# Altium schematic sheet 8_Zyntra-Ethernet.SchDoc
size 406 x 241 mm; SheetNumber: 8; SheetTotal: 10
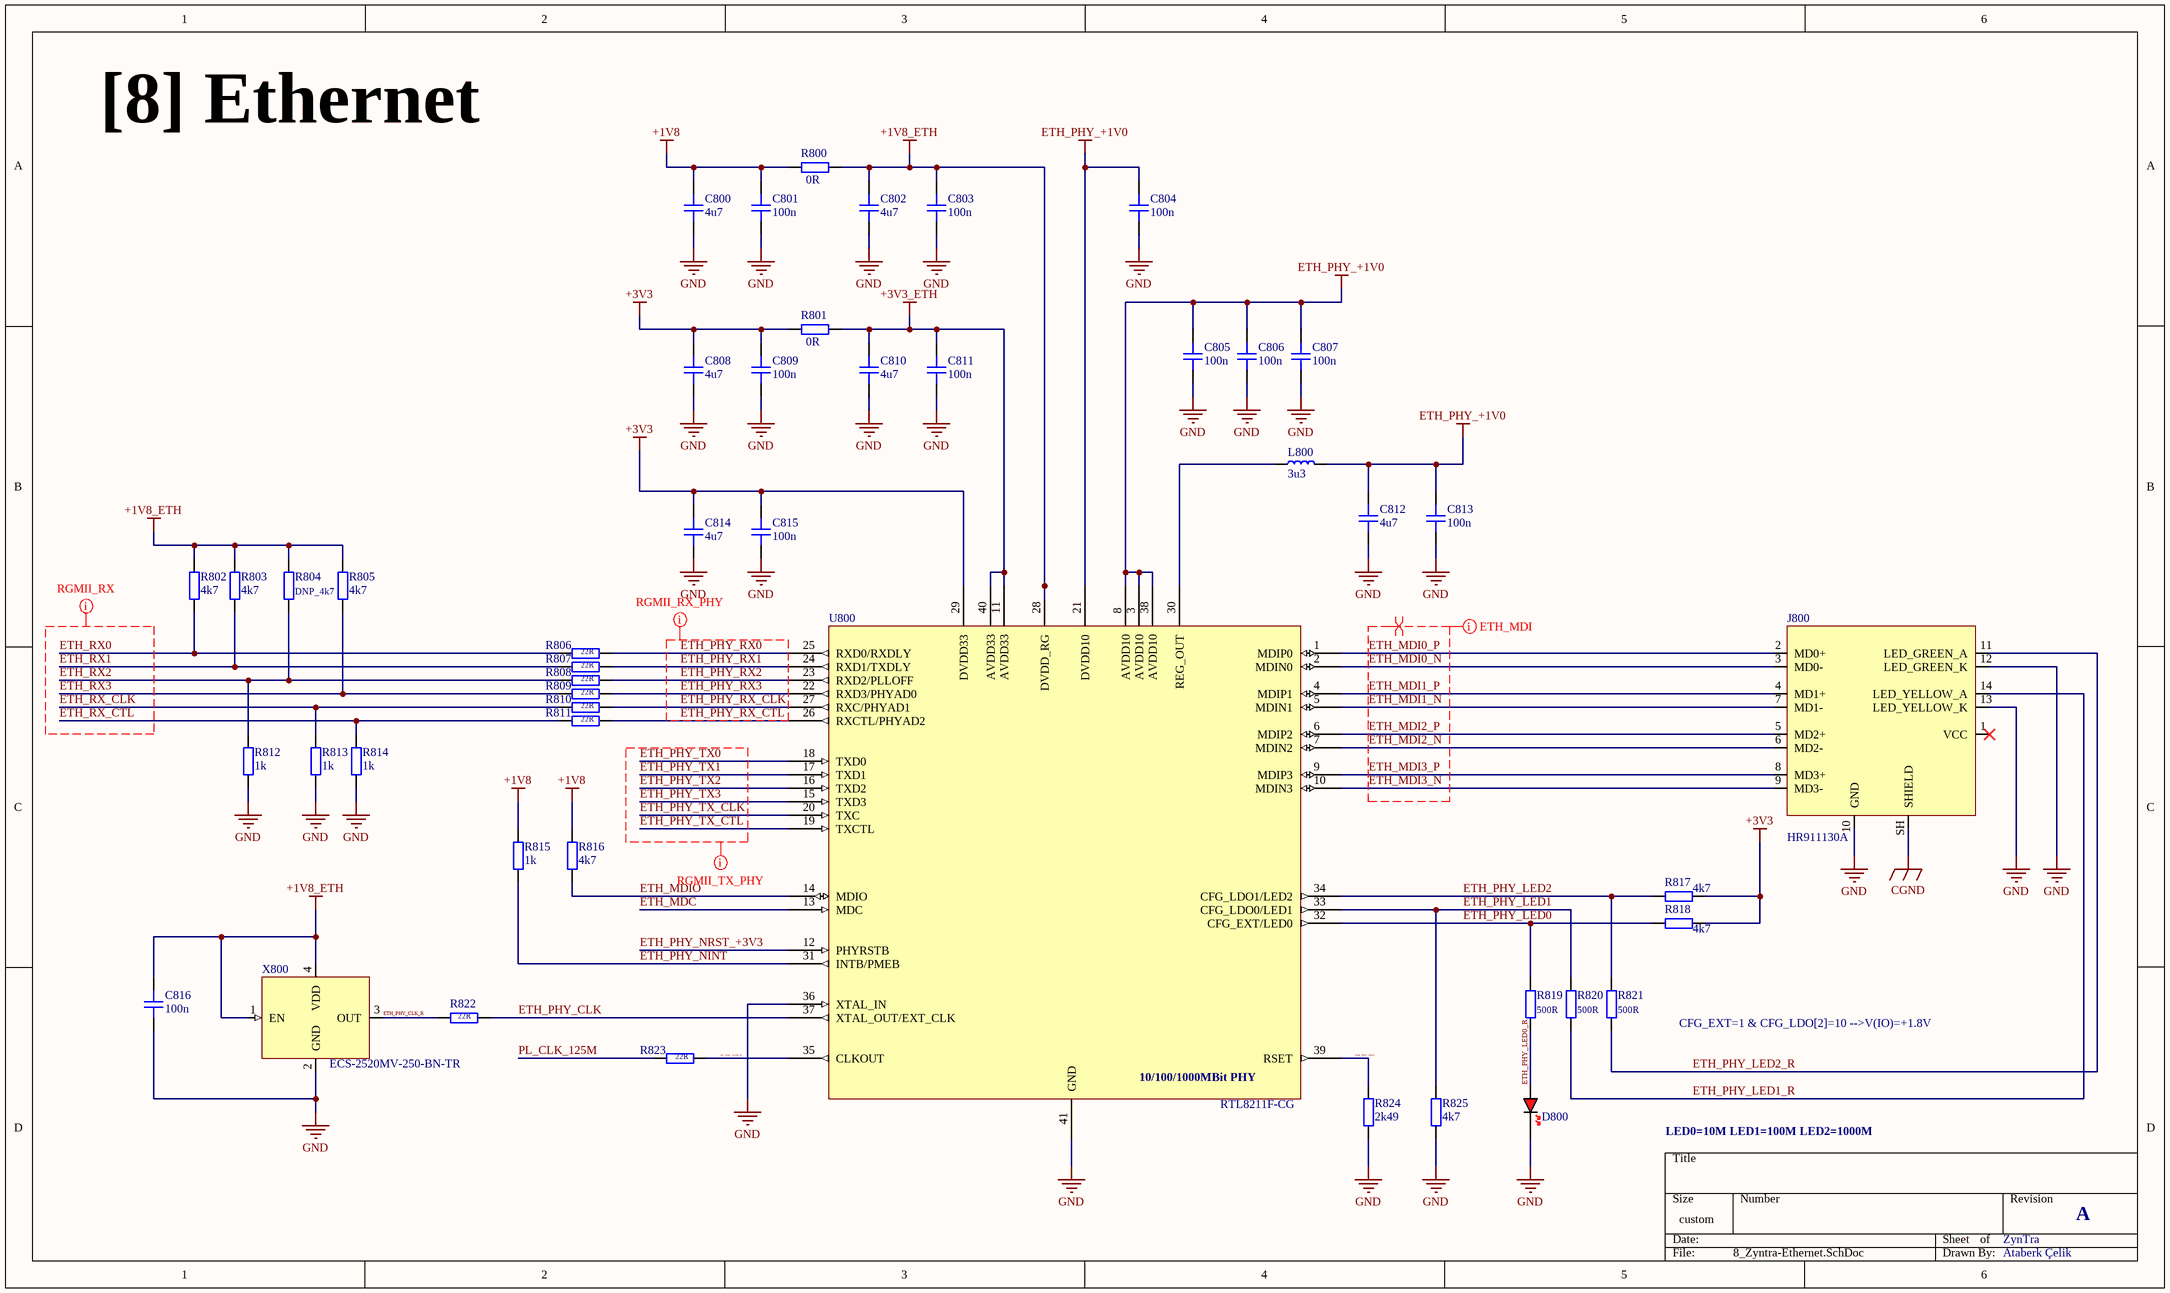
[diagram p0: 8_Zyntra-Ethernet.SchDoc]

## Parts
C800  4u7  [CAP_0201]
C801  100n  [CAP_0201]
C802  4u7  [CAP_0201]
C803  100n  [CAP_0201]
C804  100n  [CAP_0201]
C805  100n  [CAP_0201]
C806  100n  [CAP_0201]
C807  100n  [CAP_0201]
C808  4u7  [CAP_0201]
C809  100n  [CAP_0201]
C810  4u7  [CAP_0201]
C811  100n  [CAP_0201]
C812  4u7  [CAP_0201]
C813  100n  [CAP_0201]
C814  4u7  [CAP_0201]
C815  100n  [CAP_0201]
C816  100n  [CAP_0201]
D800  RED  [LED_0603_RED]  (value not drawn)
J800  HR911130A  [HR911130A]
L800  3u3  [IND_0603]
R800  0R  [RES_0402]
R801  0R  [RES_0402]
R802  4k7  [RES_0402]
R803  4k7  [RES_0402]
R804  DNP_4k7  [RES_0402]
R805  4k7  [RES_0402]
R806  22R  [RES_0402]
R807  22R  [RES_0402]
R808  22R  [RES_0402]
R809  22R  [RES_0402]
R810  22R  [RES_0402]
R811  22R  [RES_0402]
R812  1k  [RES_0402]
R813  1k  [RES_0402]
R814  1k  [RES_0402]
R815  1k  [RES_0402]
R816  4k7  [RES_0402]
R817  4k7  [RES_0402]
R818  4k7  [RES_0402]
R819  500R  [RES_0402]
R820  500R  [RES_0402]
R821  500R  [RES_0402]
R822  22R  [RES_0402]
R823  22R  [RES_0402]
R824  2k49  [RES_0402]
R825  4k7  [RES_0402]
U800  RTL8211F-CG  [QFN40, 5x5mm]
X800  ECS-2520MV-250-BN-TR  [XTAL_2520]

## Nets
+1V8: C800.2 C801.2 R800.1 R815.2 R816.2
+1V8_ETH: C802.2 C803.2 C816.2 R800.2 R802.2 R803.2 R804.2 R805.2 U800.28(DVDD_RG) X800.1(EN) X800.4(VDD)
+3V3: C808.2 C809.2 C814.2 C815.2 R801.1 R817.2 R818.2 U800.29(DVDD33)
+3V3_ETH: C810.2 C811.2 R801.2 U800.11(AVDD33) U800.40(AVDD33)
CGND: J800.SH(SHIELD)
ETH_PHY_+1V0: C804.2 C805.2 C806.2 C807.2 C812.2 C813.2 L800.2 U800.3(AVDD10) U800.8(AVDD10) U800.21(DVDD10) U800.38(AVDD10)
GND: C800.1 C801.1 C802.1 C803.1 C804.1 C805.1 C806.1 C807.1 C808.1 C809.1 C810.1 C811.1 C812.1 C813.1 C814.1 C815.1 C816.1 D800.K J800.10(GND) J800.12(LED_GREEN_K) J800.13(LED_YELLOW_K) R812.1 R813.1 R814.1 R824.2 R825.1 U800.36(XTAL_IN) U800.41(GND) X800.2(GND)
ETH_MDC: U800.13(MDC)
ETH_MDI0_N: J800.3(MD0-) U800.2(MDIN0)
ETH_MDI0_P: J800.2(MD0+) U800.1(MDIP0)
ETH_MDI1_N: J800.7(MD1-) U800.5(MDIN1)
ETH_MDI1_P: J800.4(MD1+) U800.4(MDIP1)
ETH_MDI2_N: J800.6(MD2-) U800.7(MDIN2)
ETH_MDI2_P: J800.5(MD2+) U800.6(MDIP2)
ETH_MDI3_N: J800.9(MD3-) U800.10(MDIN3)
ETH_MDI3_P: J800.8(MD3+) U800.9(MDIP3)
ETH_MDIO: R816.1 U800.14(MDIO)
ETH_PHY_CLK: R822.1 U800.37(XTAL_OUT/EXT_CLK)
ETH_PHY_CLK_R: R822.2 X800.3(OUT)
ETH_PHY_LED0: R818.1 R819.1 U800.32(CFG_EXT/LED0)
ETH_PHY_LED0_R: D800.A R819.2
ETH_PHY_LED1: R820.1 R825.2 U800.33(CFG_LDO0/LED1)
ETH_PHY_LED1_R: J800.14(LED_YELLOW_A) R820.2
ETH_PHY_LED2: R817.1 R821.1 U800.34(CFG_LDO1/LED2)
ETH_PHY_LED2_R: J800.11(LED_GREEN_A) R821.2
ETH_PHY_NINT: R815.1 U800.31(INTB/PMEB)
ETH_PHY_NRST_+3V3: U800.12(PHYRSTB)
ETH_PHY_RSET: R824.1 U800.39(RSET)
ETH_PHY_RX0: R806.1 U800.25(RXD0/RXDLY)
ETH_PHY_RX1: R807.1 U800.24(RXD1/TXDLY)
ETH_PHY_RX2: R808.1 U800.23(RXD2/PLLOFF)
ETH_PHY_RX3: R809.1 U800.22(RXD3/PHYAD0)
ETH_PHY_RX_CLK: R810.1 U800.27(RXC/PHYAD1)
ETH_PHY_RX_CTL: R811.1 U800.26(RXCTL/PHYAD2)
ETH_PHY_TX0: U800.18(TXD0)
ETH_PHY_TX1: U800.17(TXD1)
ETH_PHY_TX2: U800.16(TXD2)
ETH_PHY_TX3: U800.15(TXD3)
ETH_PHY_TX_CLK: U800.20(TXC)
ETH_PHY_TX_CTL: U800.19(TXCTL)
ETH_RX0: R802.1 R806.2
ETH_RX1: R803.1 R807.2
ETH_RX2: R804.1 R808.2 R812.2
ETH_RX3: R805.1 R809.2
ETH_RX_CLK: R810.2 R813.2
ETH_RX_CTL: R811.2 R814.2
PL_CLK_125M: R823.2
PL_CLK_125M_R: R823.1 U800.35(CLKOUT)
NetL800_1: L800.1 U800.30(REG_OUT)

Not connected (* = marked no-connect by the designer): J800 1(VCC)*

## Layout directives
net class ETH_MDI: ETH_MDI0_N, ETH_MDI0_P, ETH_MDI1_N, ETH_MDI1_P, ETH_MDI2_N, ETH_MDI2_P, ETH_MDI3_N, ETH_MDI3_P
differential pair: ETH_MDI0_N, ETH_MDI0_P, ETH_MDI1_N, ETH_MDI1_P, ETH_MDI2_N, ETH_MDI2_P, ETH_MDI3_N, ETH_MDI3_P
net class RGMII_RX; rule Matched Net Lengths [Delay Tolerance = 10ps]: ETH_RX0, ETH_RX1, ETH_RX2, ETH_RX3, ETH_RX_CLK, ETH_RX_CTL
net class RGMII_RX_PHY; rule Matched Net Lengths [Delay Tolerance = 10ps]: ETH_PHY_RX0, ETH_PHY_RX1, ETH_PHY_RX2, ETH_PHY_RX3, ETH_PHY_RX_CLK, ETH_PHY_RX_CTL
net class RGMII_TX_PHY; rule Matched Net Lengths [Delay Tolerance = 10ps]: ETH_PHY_TX0, ETH_PHY_TX1, ETH_PHY_TX2, ETH_PHY_TX3, ETH_PHY_TX_CLK, ETH_PHY_TX_CTL

## Notes on the sheet
- [8] Ethernet
- CFG_EXT=1 & CFG_LDO[2]=10 -->V(IO)=+1.8V
- LED0=10M LED1=100M LED2=1000M
- ZynTra
- A
- Ataberk Çelik
- (in symbol RTL8211F-CG) 10/100/1000MBit PHY

## Library data of the parts
C800-C816 = CAP_0201: Capacitor SMD 0201; Manufacturer: *; Manufacturer Part Number: *; Distributor Link: *; LCSC: *; Rating: *; Dielectric: *
D800 = LED_0603_RED: LED 0603 RED SMD
J800 = HR911130A: 100/1000Base-T Magnetics Single-Port RJ45 Connector with Integrated Magnetics and LEDs; Manufacturer: Hanrun; Manufacturer Part Number: HR911130A
L800 = IND_0603: Inductor SMD 0603
R800-R825 = RES_0402: Resistor SMD 0402; Manufacturer: *; Manufacturer Part Number: *; Distributor Link: *; LCSC: *
U800 = RTL8211F-CG: INTEGRATED 10/100/1000M ETHERNET / PRECISION TRANSCEIVER; Manufacturer: REALTEK; Manufacturer Part Number: RTL8211F-CG; Supplier Link: https://www.lcsc.com/product-detail/C187932.html?s_z=n_RTL8211F&spm=wm.ssy.bg.0.xh&lcsc_vid=TlhdUFxUFlMPVQBfQVRXA1RWFlhcUlVfT1JaVgVWRwcxVlNRQlFWVFRSRVdXUjsOAxUeFF5JWBYZEEoKFBINSQcJGk4eFQsCAgIaFA%3D%3D
X800 = ECS-2520MV-130-BN-TR: Standard Clock Oscillators XO (Standard),13MHz,Standby (Power Down),CMOS, Multi-Volt,1.6 V 3.6 V,+/-50ppm,-40 C 85 C,6mA,Surface Mount,4-SMD, No Lead,(2.50mm x 2.00mm),(0.80mm); Manufacturer: ECS; Manufacturer Part Number: ECS-2520MV-130-BN-TR